# Altium schematic sheet W5500.SchDoc
size A4; SheetNumber: 8; SheetTotal: 9
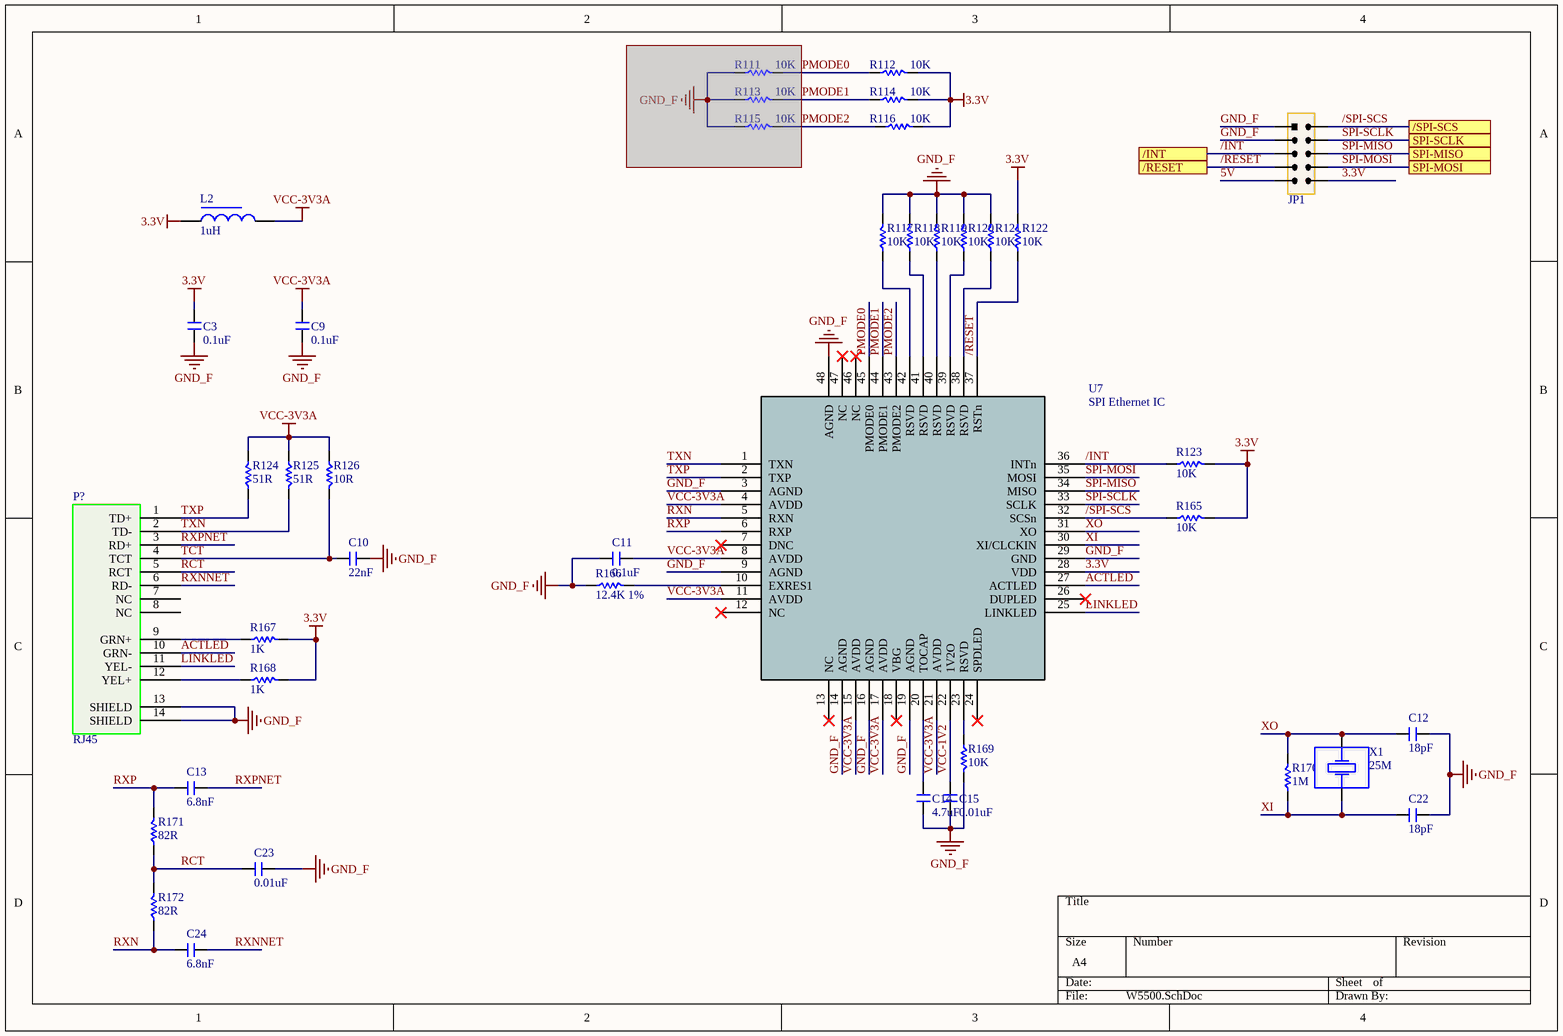
[diagram p0: W5500.SchDoc]

## Parts
C3  0.1uF  [C 0805]
C9  0.1uF  [C 0805]
C10  22nF  [C 0805]
C11  0.1uF  [C 0805]
C12  18pF  [C 0805]
C13  6.8nF  [C 0805]
C14  4.7uF  [C 0805]
C15  0.01uF  [C 0805]
C22  18pF  [C 0805]
C23  0.01uF  [C 0805]
C24  6.8nF  [C 0805]
JP1  Header 5X2  [HDR-5X2]  (value not drawn)
L2  1uH  [L 0805]
P?  RJ45  [RJ-45A12]
R111  10K  [R 0805]  (masked out: inside a compile mask, not in the netlist)
R112  10K  [R 0805]
R113  10K  [R 0805]  (masked out: inside a compile mask, not in the netlist)
R114  10K  [R 0805]
R115  10K  [R 0805]  (masked out: inside a compile mask, not in the netlist)
R116  10K  [R 0805]
R117  10K  [R 0805]
R118  10K  [R 0805]
R119  10K  [R 0805]
R120  10K  [R 0805]
R121  10K  [R 0805]
R122  10K  [R 0805]
R123  10K  [R 0805]
R124  51R  [R 0805]
R125  51R  [R 0805]
R126  10R  [R 0805]
R165  10K  [R 0805]
R166  12.4K 1%  [R 0805]
R167  1K  [R 0805]
R168  1K  [R 0805]
R169  10K  [R 0805]
R170  1M  [R 0805]
R171  82R  [R 0805]
R172  82R  [R 0805]
U7  SPI Ethernet IC  [LQFP48 7X7_L]
X1  25M  [XTAL-HC49S-THD]

## Ports
/INT, /RESET, /SPI-SCS, SPI-MISO, SPI-MOSI, SPI-SCLK

## Nets
3.3V: C3.2 JP1.10 L2.1 R112.2 R114.2 R116.2 R122.2 R123.2 R165.2 R167.2 R168.2 U7.28(VDD)
GND_F: C3.1 C9.1 C10.2 C11.1 C12.2 C14.2 C15.2 C22.2 C23.2 JP1.1 JP1.3 P?.13(SHIELD) P?.14(SHIELD) R117.2 R118.2 R119.2 R120.2 R121.2 R166.1 R169.2 U7.3(AGND) U7.9(AGND) U7.14(AGND) U7.16(AGND) U7.19(AGND) U7.29(GND) U7.48(AGND)
VCC-3V3A: C9.2 C11.2 L2.2 R124.2 R125.1 R126.1 U7.4(AVDD) U7.8(AVDD) U7.11(AVDD) U7.15(AVDD) U7.17(AVDD) U7.21(AVDD)
5V: JP1.9
/INT: JP1.5 R123.1 U7.36(INTn) ; port /INT
/RESET: JP1.7 R122.1 U7.37(RSTn) ; port /RESET
/SPI-SCS: JP1.2 R165.1 U7.32(SCSn) ; port /SPI-SCS
ACTLED: P?.10(GRN-) U7.27(ACTLED)
LINKLED: P?.11(YEL-) U7.25(LINKLED)
PMODE0: U7.45(PMODE0)
PMODE1: U7.44(PMODE1)
PMODE2: U7.43(PMODE2)
RCT: C23.1 P?.5(RCT) R171.1 R172.2
RXN: C24.1 R172.1 U7.5(RXN)
RXNNET: C24.2 P?.6(RD-)
RXP: C13.1 R171.2 U7.6(RXP)
RXPNET: C13.2 P?.3(RD+)
SPI-MISO: JP1.6 U7.34(MISO) ; port SPI-MISO
SPI-MOSI: JP1.8 U7.35(MOSI) ; port SPI-MOSI
SPI-SCLK: JP1.4 U7.33(SCLK) ; port SPI-SCLK
TCT: C10.1 P?.4(TCT) R126.2
TXN: P?.2(TD-) R125.2 U7.1(TXN)
TXP: P?.1(TD+) R124.1 U7.2(TXP)
VCC-1V2: C15.1 U7.22(1V2O)
XI: C22.1 R170.1 U7.30(XI/CLCKIN) X1.1
XO: C12.1 R170.2 U7.31(XO) X1.2
NetC14_1: C14.1 U7.20(TOCAP)
NetP?_9: P?.9(GRN+) R167.1
NetP?_12: P?.12(YEL+) R168.1
NetR117_1: R117.1 U7.42(RSVD)
NetR118_1: R118.1 U7.41(RSVD)
NetR119_1: R119.1 U7.40(RSVD)
NetR120_1: R120.1 U7.39(RSVD)
NetR121_1: R121.1 U7.38(RSVD)
NetR166_2: R166.2 U7.10(EXRES1)
NetR169_1: R169.1 U7.23(RSVD)

Not connected (* = marked no-connect by the designer): P? 7(NC) 8(NC); R112 1; R114 1; R116 1; U7 7(DNC)* 12(NC)* 13(NC)* 18(VBG)* 24(SPDLED)* 26(DUPLED)* 46(NC)* 47(NC)*

## Library data of the parts
C3 C9-C15 C22-C24 = C: Non-polar patch capacitor; BOM名称: 无极性贴片电容; 版权归属: 源创客; 学习资源: www.ooocke.com
JP1 = Header 5X2: 5*2P Connector; BOM名称: 5*2P接插件; 版权归属: 源创客; 学习资源: www.ooocke.com
L2 = L: Low power chip inductor; BOM名称: 小功率贴片电感; 版权归属: 源创客; 学习资源: www.ooocke.com
P? = RJ45 LED
R111-R126 R165-R172 = R: Chip resistor; 版权归属: 源创客; BOM名称: Chip resistor; 学习资源: www.ooocke.com
U7 = W5500
X1 = XTAL-2: 2-Pin crystal; BOM名称: 2脚晶振; 版权归属: 源创客; 学习资源: www.ooocke.com